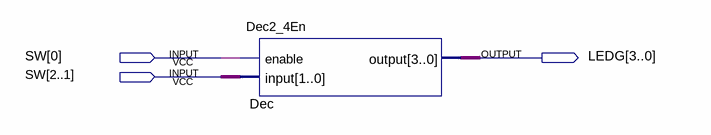
[diagram p0: schematic sheet]
// Quartus schematic Dec2_4EnDemo.bdf as structural Verilog: 1 symbols, 3 pins
module Dec2_4EnDemo (
  input  [2:0] SW,
  output [3:0] LEDG
);

  Dec2_4En Dec (.enable(SW[0]), .\input (SW[2:1]), .\output (LEDG));
endmodule
